# Altium schematic sheet Relay Output.SchDoc
size A2
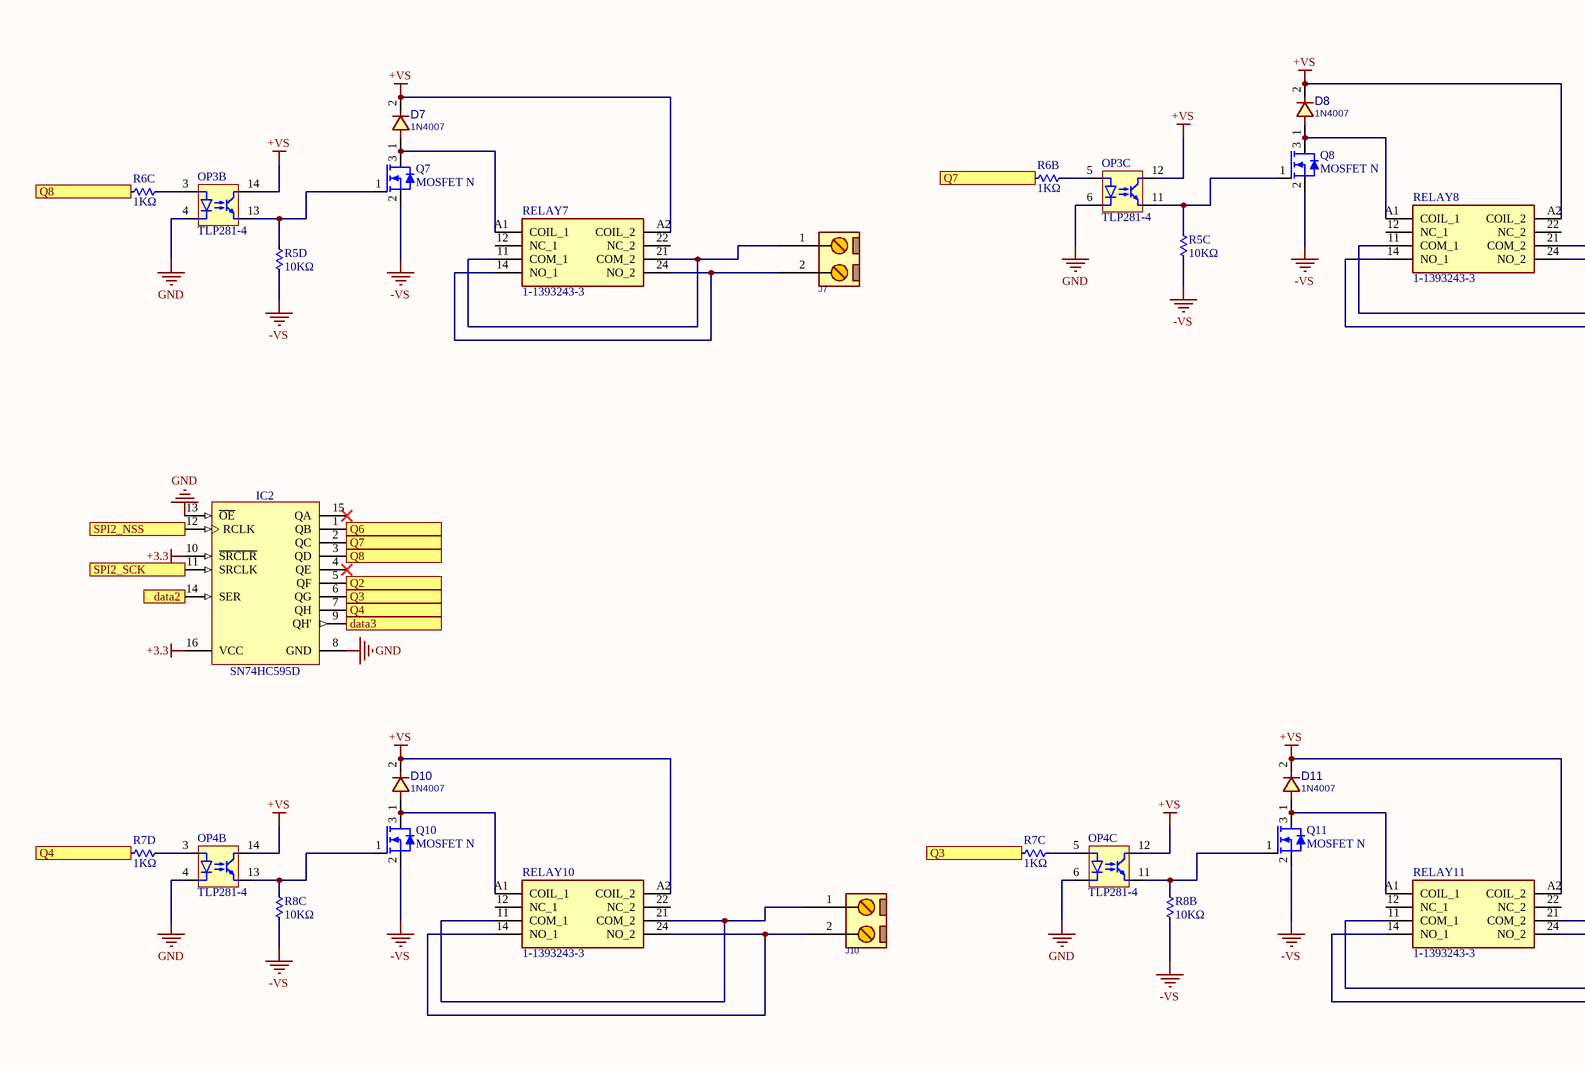
[diagram p0: Relay Output.SchDoc, top left]
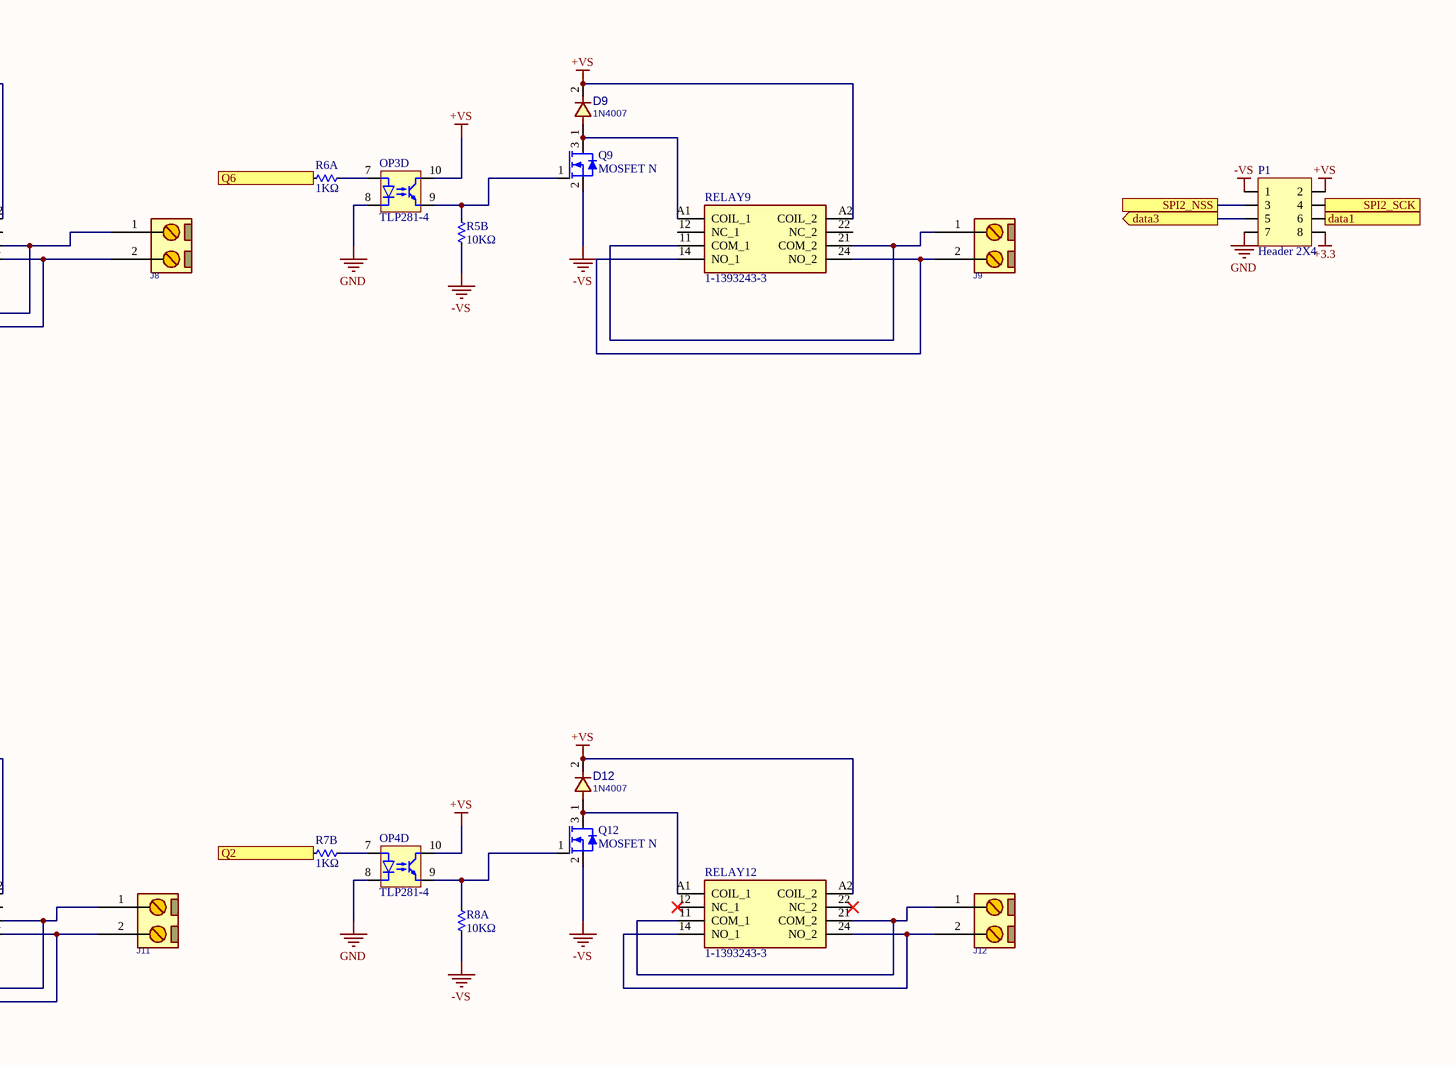
[diagram p1: Relay Output.SchDoc, top right]
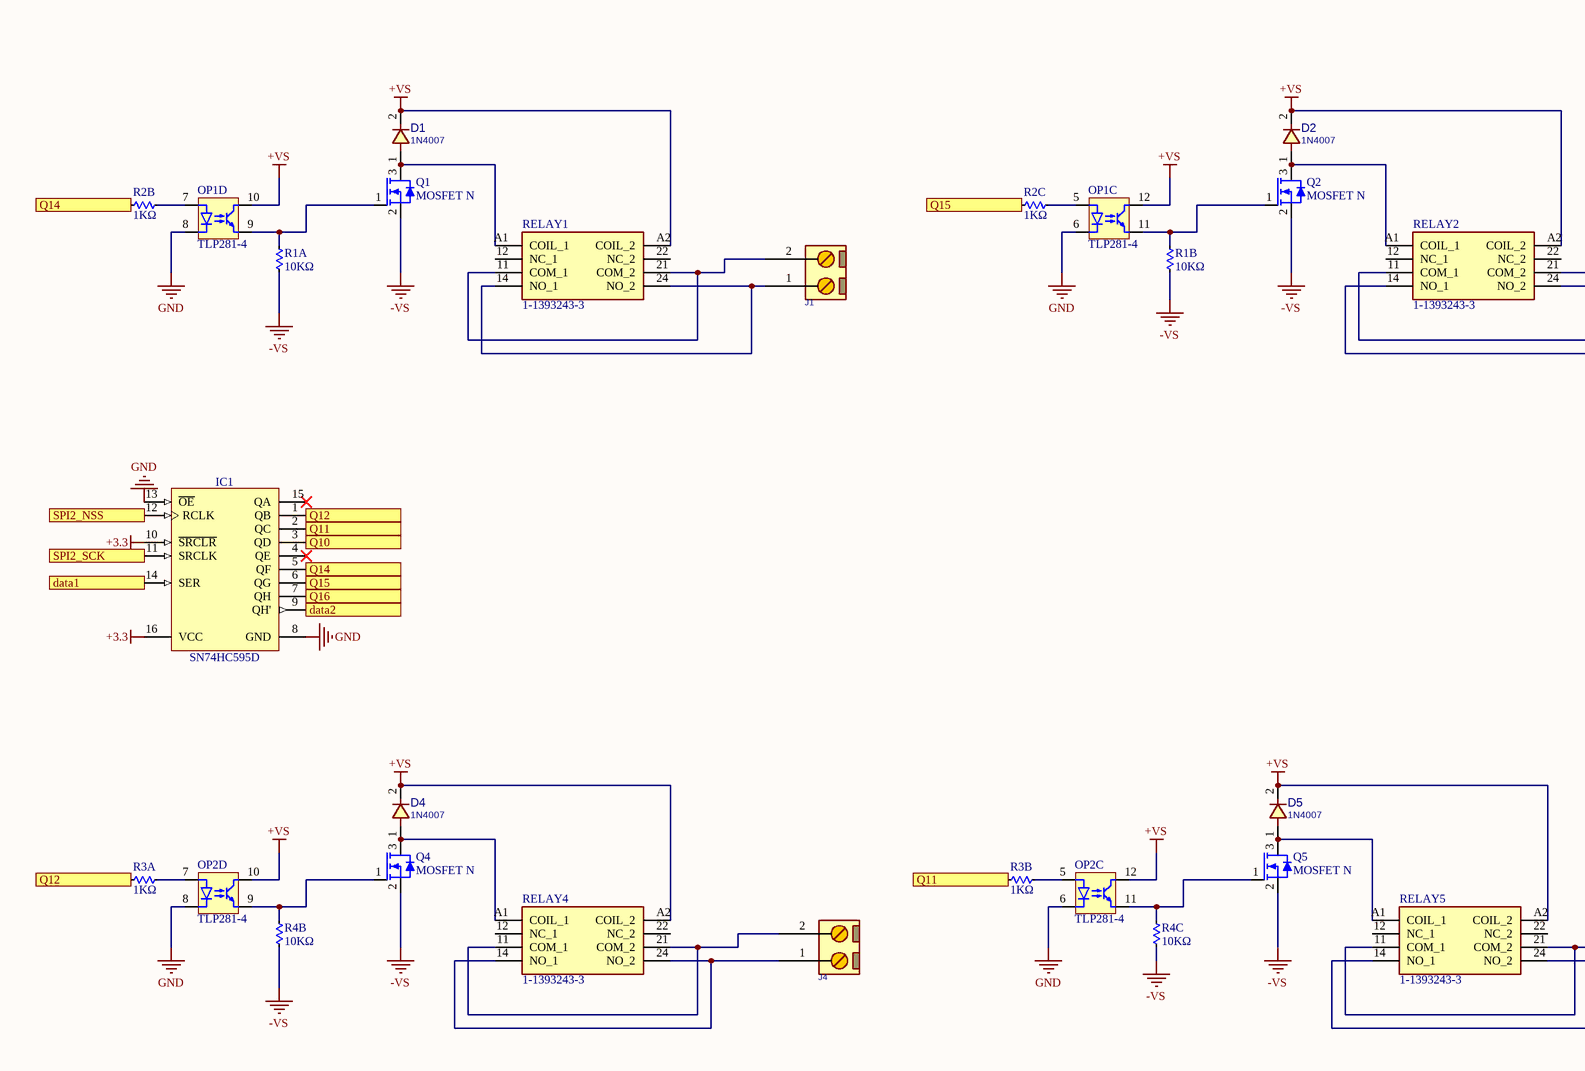
[diagram p2: Relay Output.SchDoc, bottom left]
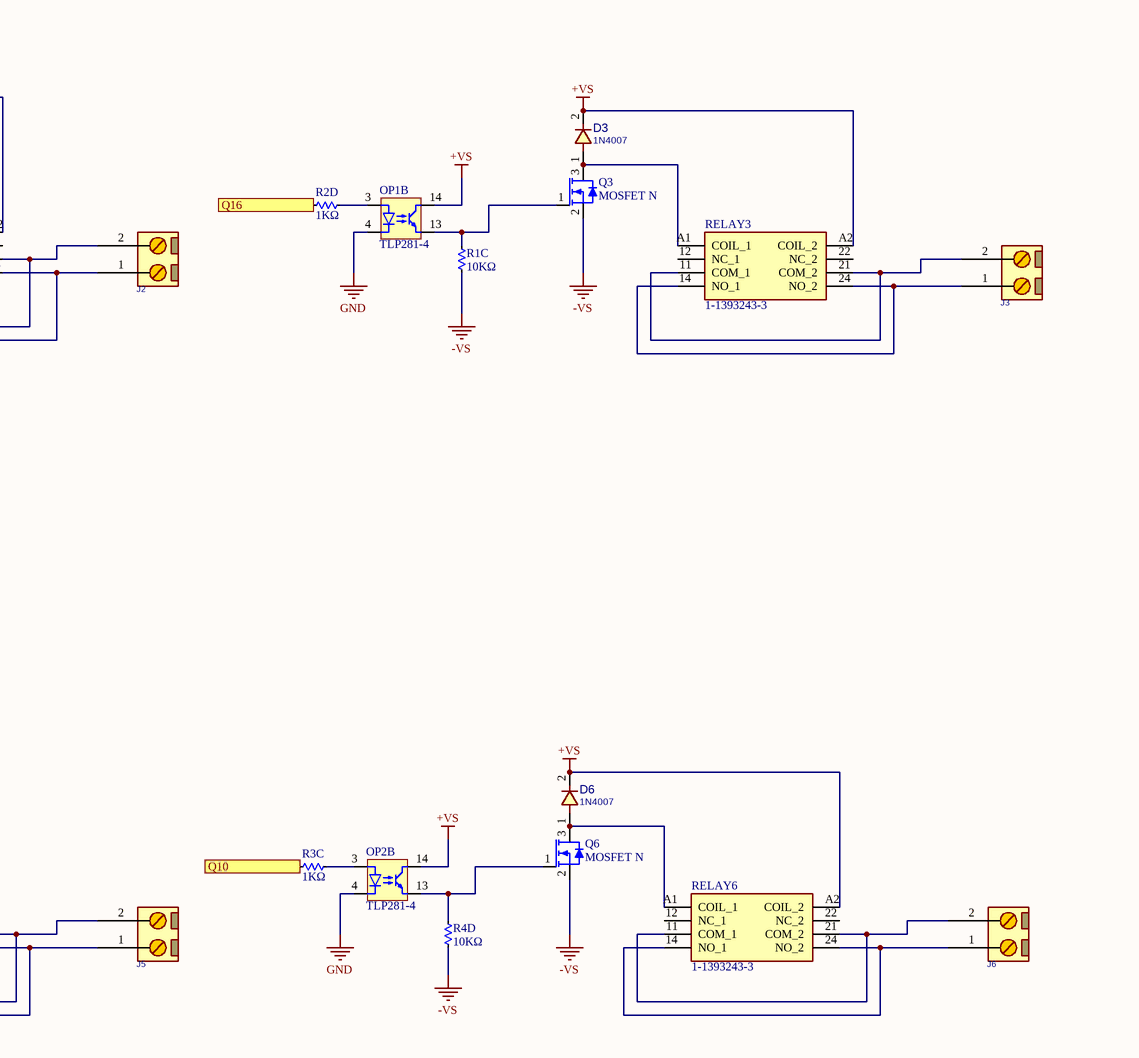
[diagram p3: Relay Output.SchDoc, bottom right]

## Parts
D1  1N4007  [D_SMA]
D2  1N4007  [D_SMA]
D3  1N4007  [D_SMA]
D4  1N4007  [D_SMA]
D5  1N4007  [D_SMA]
D6  1N4007  [D_SMA]
D7  1N4007  [D_SMA]
D8  1N4007  [D_SMA]
D9  1N4007  [D_SMA]
D10  1N4007  [D_SMA]
D11  1N4007  [D_SMA]
D12  1N4007  [D_SMA]
IC1  SN74HC595D  [SOIC127P600X175-16N]
IC2  SN74HC595D  [SOIC127P600X175-16N]
J1  CONN_TB2  [TBG_2]  (value not drawn)
J2  CONN_TB2  [TBG_2]  (value not drawn)
J3  CONN_TB2  [TBG_2]  (value not drawn)
J4  CONN_TB2  [TBG_2]  (value not drawn)
J5  CONN_TB2  [TBG_2]  (value not drawn)
J6  CONN_TB2  [TBG_2]  (value not drawn)
J7  CONN_TB2  [TBG_2]  (value not drawn)
J8  CONN_TB2  [TBG_2]  (value not drawn)
J9  CONN_TB2  [TBG_2]  (value not drawn)
J10  CONN_TB2  [TBG_2]  (value not drawn)
J11  CONN_TB2  [TBG_2]  (value not drawn)
J12  CONN_TB2  [TBG_2]  (value not drawn)
OP1  TLP281-4  [SO16 TOSHIBA OPTOCOUPLER]  (parts B,C,D of 4)
OP2  TLP281-4  [SO16 TOSHIBA OPTOCOUPLER]  (parts B,C,D of 4)
OP3  TLP281-4  [SO16 TOSHIBA OPTOCOUPLER]  (parts B,C,D of 4)
OP4  TLP281-4  [SO16 TOSHIBA OPTOCOUPLER]  (parts B,C,D of 4)
P1  Header 2X4  [HDR 2X4 F ST 2.54]
Q1  MOSFET N  [SOT23]
Q2  MOSFET N  [SOT23]
Q3  MOSFET N  [SOT23]
Q4  MOSFET N  [SOT23]
Q5  MOSFET N  [SOT23]
Q6  MOSFET N  [SOT23]
Q7  MOSFET N  [SOT23]
Q8  MOSFET N  [SOT23]
Q9  MOSFET N  [SOT23]
Q10  MOSFET N  [SOT23]
Q11  MOSFET N  [SOT23]
Q12  MOSFET N  [SOT23]
R1  10KΩ  [RES ARRAY 4X0603 10K]  (parts A,B,C of 4)
R2  1KΩ  [RES ARRAY 4X0603 1K]  (parts B,C,D of 4)
R3  1KΩ  [RES ARRAY 4X0603 1K]  (parts A,B,C of 4)
R4  10KΩ  [RES ARRAY 4X0603 10K]  (parts B,C,D of 4)
R5  10KΩ  [RES ARRAY 4X0603 10K]  (parts B,C,D of 4)
R6  1KΩ  [RES ARRAY 4X0603 1K]  (parts A,B,C of 4)
R7  1KΩ  [RES ARRAY 4X0603 1K]  (parts B,C,D of 4)
R8  10KΩ  [RES ARRAY 4X0603 10K]  (parts A,B,C of 4)
RELAY1  1-1393243-3  [113932433]
RELAY2  1-1393243-3  [113932433]
RELAY3  1-1393243-3  [113932433]
RELAY4  1-1393243-3  [113932433]
RELAY5  1-1393243-3  [113932433]
RELAY6  1-1393243-3  [113932433]
RELAY7  1-1393243-3  [113932433]
RELAY8  1-1393243-3  [113932433]
RELAY9  1-1393243-3  [113932433]
RELAY10  1-1393243-3  [113932433]
RELAY11  1-1393243-3  [113932433]
RELAY12  1-1393243-3  [113932433]

## Ports
data1, data1 (out), data2, data2 (out), data3 (out), Q2 (out), Q3 (out), Q4 (out), Q6 (out), Q7 (out), Q8 (out), Q10 (out), Q11 (out), Q12 (out), Q14 (out), Q15 (out), Q16 (out), SPI2_NSS, SPI2_SCK

## Nets
+3.3: IC1.10(~{SRCLR}) IC1.16(VCC) IC2.10(~{SRCLR}) IC2.16(VCC) P1.8
+VS: D1.2 D2.2 D3.2 D4.2 D5.2 D6.2 D7.2 D8.2 D9.2 D10.2 D11.2 D12.2 OP1.10 OP1.12 OP1.14 OP2.10 OP2.12 OP2.14 OP3.10 OP3.12 OP3.14 OP4.10 OP4.12 OP4.14 P1.2 RELAY1.A2(COIL_2) RELAY2.A2(COIL_2) RELAY3.A2(COIL_2) RELAY4.A2(COIL_2) RELAY5.A2(COIL_2) RELAY6.A2(COIL_2) RELAY7.A2(COIL_2) RELAY8.A2(COIL_2) RELAY9.A2(COIL_2) RELAY10.A2(COIL_2) RELAY11.A2(COIL_2) RELAY12.A2(COIL_2)
-VS: P1.1 Q1.2(S) Q2.2(S) Q3.2(S) Q4.2(S) Q5.2(S) Q6.2(S) Q7.2(S) Q8.2(S) Q9.2(S) Q10.2(S) Q11.2(S) Q12.2(S) R1.6 R1.7 R1.8 R4.5 R4.6 R4.7 R5.5 R5.6 R5.7 R8.6 R8.7 R8.8
GND: IC1.8(GND) IC1.13(~{OE}) IC2.8(GND) IC2.13(~{OE}) OP1.4 OP1.6 OP1.8 OP2.4 OP2.6 OP2.8 OP3.4 OP3.6 OP3.8 OP4.4 OP4.6 OP4.8 P1.7
data1: IC1.14(SER) P1.6 ; port data1
data2: IC1.9(QH') IC2.14(SER) ; port data2
data3: IC2.9(QH') P1.5 ; port data3
Q2: IC2.5(QF) R7.2 ; port Q2
Q3: IC2.6(QG) R7.3 ; port Q3
Q4: IC2.7(QH) R7.4 ; port Q4
Q6: IC2.1(QB) R6.1 ; port Q6
Q7: IC2.2(QC) R6.2 ; port Q7
Q8: IC2.3(QD) R6.3 ; port Q8
Q10: IC1.3(QD) R3.3 ; port Q10
Q11: IC1.2(QC) R3.2 ; port Q11
Q12: IC1.1(QB) R3.1 ; port Q12
Q14: IC1.5(QF) R2.2 ; port Q14
Q15: IC1.6(QG) R2.3 ; port Q15
Q16: IC1.7(QH) R2.4 ; port Q16
SPI2_NSS: IC1.12(RCLK) IC2.12(RCLK) P1.3 ; port SPI2_NSS
SPI2_SCK: IC1.11(SRCLK) IC2.11(SRCLK) P1.4 ; port SPI2_SCK
NetD1_1: D1.1 Q1.3(D) RELAY1.A1(COIL_1)
NetD2_1: D2.1 Q2.3(D) RELAY2.A1(COIL_1)
NetD3_1: D3.1 Q3.3(D) RELAY3.A1(COIL_1)
NetD4_1: D4.1 Q4.3(D) RELAY4.A1(COIL_1)
NetD5_1: D5.1 Q5.3(D) RELAY5.A1(COIL_1)
NetD6_1: D6.1 Q6.3(D) RELAY6.A1(COIL_1)
NetD7_1: D7.1 Q7.3(D) RELAY7.A1(COIL_1)
NetD8_1: D8.1 Q8.3(D) RELAY8.A1(COIL_1)
NetD9_1: D9.1 Q9.3(D) RELAY9.A1(COIL_1)
NetD10_1: D10.1 Q10.3(D) RELAY10.A1(COIL_1)
NetD11_1: D11.1 Q11.3(D) RELAY11.A1(COIL_1)
NetD12_1: D12.1 Q12.3(D) RELAY12.A1(COIL_1)
NetJ1_1: J1.1 RELAY1.14(NO_1) RELAY1.24(NO_2)
NetJ1_2: J1.2 RELAY1.11(COM_1) RELAY1.21(COM_2)
NetJ2_1: J2.1 RELAY2.14(NO_1) RELAY2.24(NO_2)
NetJ2_2: J2.2 RELAY2.11(COM_1) RELAY2.21(COM_2)
NetJ3_1: J3.1 RELAY3.14(NO_1) RELAY3.24(NO_2)
NetJ3_2: J3.2 RELAY3.11(COM_1) RELAY3.21(COM_2)
NetJ4_1: J4.1 RELAY4.14(NO_1) RELAY4.24(NO_2)
NetJ4_2: J4.2 RELAY4.11(COM_1) RELAY4.21(COM_2)
NetJ5_1: J5.1 RELAY5.14(NO_1) RELAY5.24(NO_2)
NetJ5_2: J5.2 RELAY5.11(COM_1) RELAY5.21(COM_2)
NetJ6_1: J6.1 RELAY6.14(NO_1) RELAY6.24(NO_2)
NetJ6_2: J6.2 RELAY6.11(COM_1) RELAY6.21(COM_2)
NetJ7_1: J7.1 RELAY7.11(COM_1) RELAY7.21(COM_2)
NetJ7_2: J7.2 RELAY7.14(NO_1) RELAY7.24(NO_2)
NetJ8_1: J8.1 RELAY8.11(COM_1) RELAY8.21(COM_2)
NetJ8_2: J8.2 RELAY8.14(NO_1) RELAY8.24(NO_2)
NetJ9_1: J9.1 RELAY9.11(COM_1) RELAY9.21(COM_2)
NetJ9_2: J9.2 RELAY9.14(NO_1) RELAY9.24(NO_2)
NetJ10_1: J10.1 RELAY10.11(COM_1) RELAY10.21(COM_2)
NetJ10_2: J10.2 RELAY10.14(NO_1) RELAY10.24(NO_2)
NetJ11_1: J11.1 RELAY11.11(COM_1) RELAY11.21(COM_2)
NetJ11_2: J11.2 RELAY11.14(NO_1) RELAY11.24(NO_2)
NetJ12_1: J12.1 RELAY12.11(COM_1) RELAY12.21(COM_2)
NetJ12_2: J12.2 RELAY12.14(NO_1) RELAY12.24(NO_2)
NetOP1_3: OP1.3 R2.5
NetOP1_5: OP1.5 R2.6
NetOP1_7: OP1.7 R2.7
NetOP1_9: OP1.9 Q1.1(G) R1.1
NetOP1_11: OP1.11 Q2.1(G) R1.2
NetOP1_13: OP1.13 Q3.1(G) R1.3
NetOP2_3: OP2.3 R3.6
NetOP2_5: OP2.5 R3.7
NetOP2_7: OP2.7 R3.8
NetOP2_9: OP2.9 Q4.1(G) R4.2
NetOP2_11: OP2.11 Q5.1(G) R4.3
NetOP2_13: OP2.13 Q6.1(G) R4.4
NetOP3_3: OP3.3 R6.6
NetOP3_5: OP3.5 R6.7
NetOP3_7: OP3.7 R6.8
NetOP3_9: OP3.9 Q9.1(G) R5.2
NetOP3_11: OP3.11 Q8.1(G) R5.3
NetOP3_13: OP3.13 Q7.1(G) R5.4
NetOP4_3: OP4.3 R7.5
NetOP4_5: OP4.5 R7.6
NetOP4_7: OP4.7 R7.7
NetOP4_9: OP4.9 Q12.1(G) R8.1
NetOP4_11: OP4.11 Q11.1(G) R8.2
NetOP4_13: OP4.13 Q10.1(G) R8.3

Not connected (* = marked no-connect by the designer): IC1 4(QE)* 15(QA)*; IC2 4(QE)* 15(QA)*; RELAY1 12(NC_1) 22(NC_2); RELAY2 12(NC_1) 22(NC_2); RELAY3 12(NC_1) 22(NC_2); RELAY4 12(NC_1) 22(NC_2); RELAY5 12(NC_1) 22(NC_2); RELAY6 12(NC_1) 22(NC_2); RELAY7 12(NC_1) 22(NC_2); RELAY8 12(NC_1) 22(NC_2); RELAY9 12(NC_1) 22(NC_2); RELAY10 12(NC_1) 22(NC_2); RELAY11 12(NC_1) 22(NC_2); RELAY12 12(NC_1)* 22(NC_2)*

## Library data of the parts
D1-D12 = DIODE_SMD_1N4007: DIODE, GENERAL PURPOSE, 1000V/1A; MANF: Kingtronics; DESC: DESCRIPTION; PARAM: 1000V VRRM; PARAM2: 1A; MANF_P#: M7; ASSEMBLY: ASSEMBLY; PRICE: PRICE; VALUE: 1N4007
IC1 IC2 = SN74HC595D: 8-Bit Shift Register With 3-State Output Register; Part Description: 8-Bit Shift Register With 3-State Output Registers; Manufacturer: TEXAS INSTRUMENTS; PressFit: No; Bonding: No; Part Number: SN74HC595D; Component Kind: Standard; Component Type: Standard; Device: SN74HC595D; PackageDescription: SOIC 16, Pitch 1.27mm - Body 4x10mm, IPC Medium Density; Manufacturer Part Number: SN74HC595D; Pin Count: 16; Case: SOIC16; Mounted: Yes; Socket: No; SMD: Yes; Sense: No; ComponentHeight: 1.75mm; Author: CERN DEM JLC; HelpURL: \\cern.ch\dfs\Applications\Altium\Datasheets\SN74HC595D.pdf; CreateDate: 6/5/2012; LatestRevisionDate: 6/5/2012
J1-J12 = CONN_TB2: CONN, TERMINAL BLOCK, 5.08mm pitch; VALUE: CONN_TB2
R1 R4 R5 R8 = RES ARRAY 10K
R2 R3 R6 R7 = RES ARRAY 1K
RELAY1-RELAY12 = 1-1393243-3: Connector; Manufacturer_Name: TE Connectivity; Datasheet Link: https://www.mouser.com/datasheet/2/418/NG_DS_RT2_1014-579056.pdf; Height: 15.7mm; Manufacturer_Part_Number: 1-1393243-3; Arrow Part Number: 1-1393243-3; Mouser Part Number: 655-1-1393243-3; Mouser Price/Stock: https://www.mouser.co.uk/ProductDetail/TE-Connectivity-Schrack/1-1393243-3?qs=8%252BfS01R0SwJTLBx3JmwCzA%3D%3D